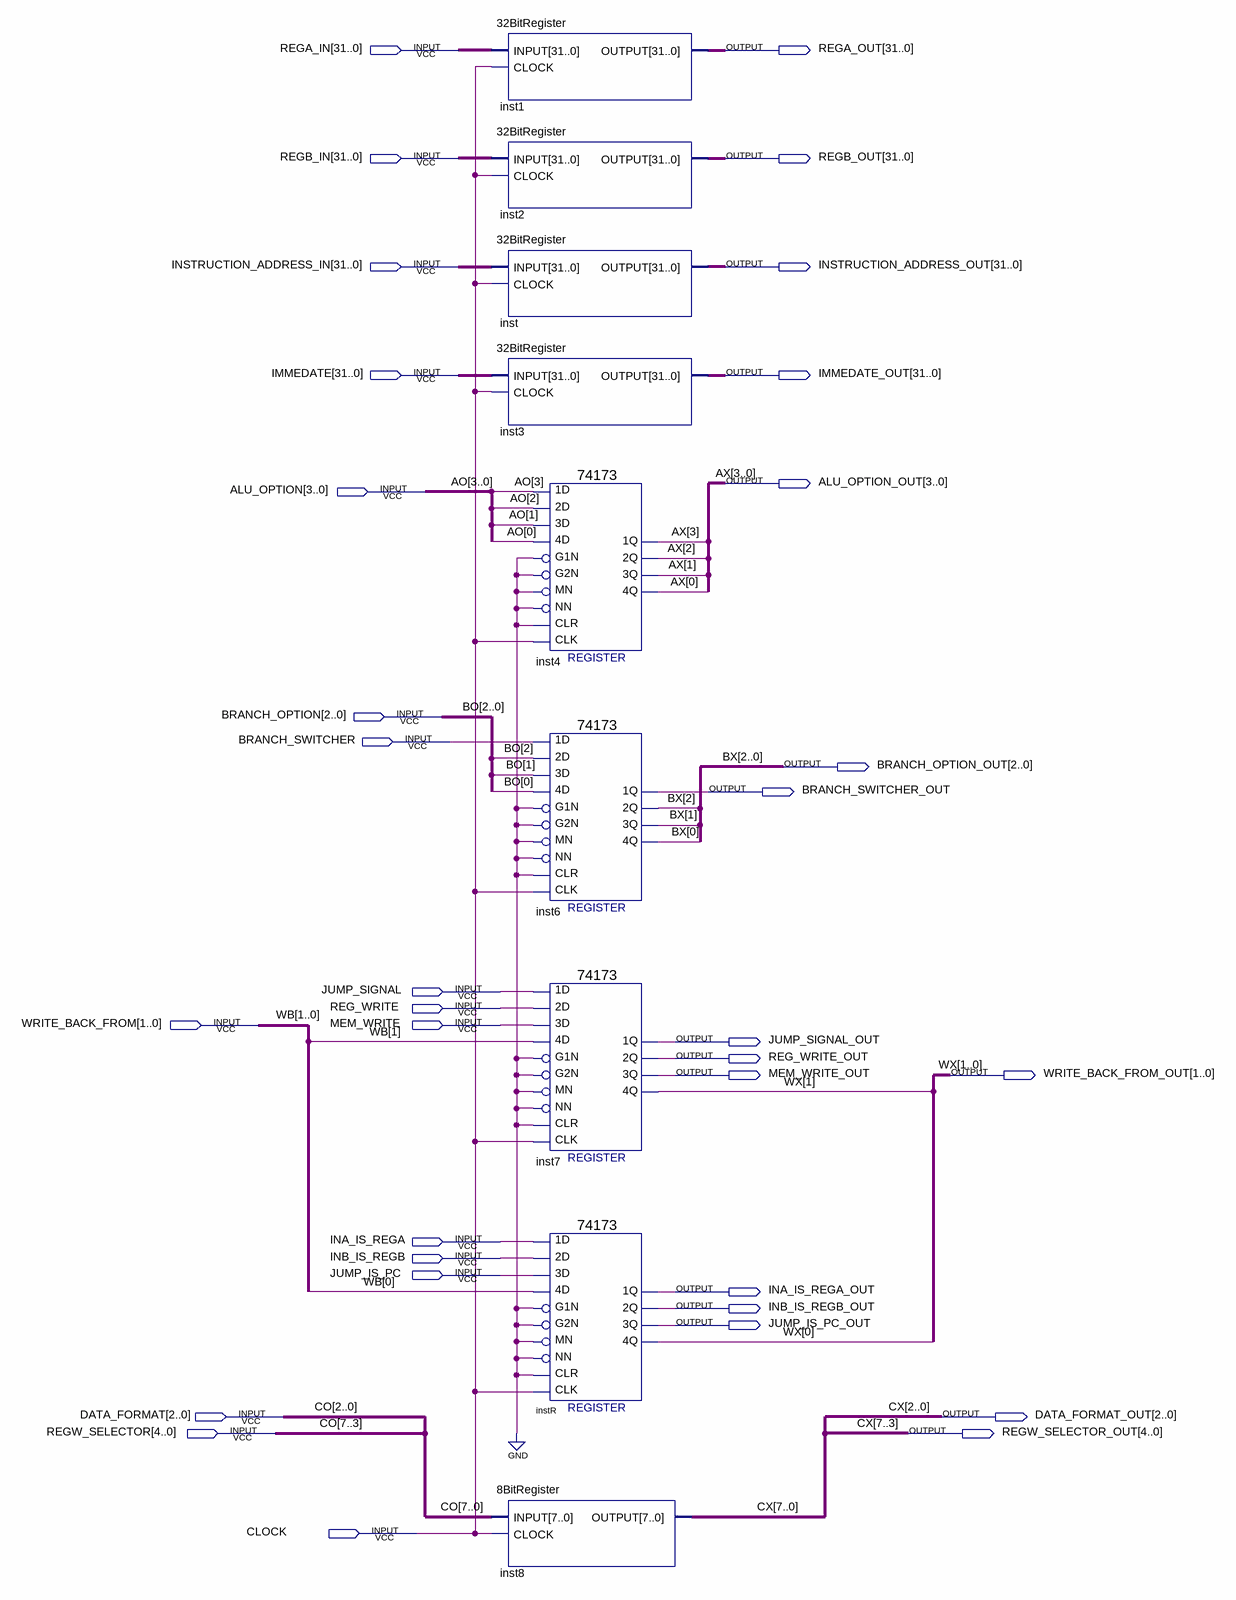
[diagram p0: schematic sheet]
// Quartus schematic DECODE_EXECUTE.bdf as structural Verilog: 9 symbols, 33 pins
module DECODE_EXECUTE (
  input  [31:0] REGA_IN,
  input  [31:0] REGB_IN,
  input  [31:0] INSTRUCTION_ADDRESS_IN,
  input  [31:0] IMMEDATE,
  input  [3:0] ALU_OPTION,
  input  [2:0] BRANCH_OPTION,
  input  BRANCH_SWITCHER,
  input  JUMP_SIGNAL,
  input  REG_WRITE,
  input  [1:0] WRITE_BACK_FROM,
  input  MEM_WRITE,
  input  INA_IS_REGA,
  input  INB_IS_REGB,
  input  JUMP_IS_PC,
  input  [2:0] DATA_FORMAT,
  input  [4:0] REGW_SELECTOR,
  input  CLOCK,
  output [31:0] REGA_OUT,
  output [31:0] REGB_OUT,
  output [31:0] INSTRUCTION_ADDRESS_OUT,
  output [31:0] IMMEDATE_OUT,
  output [3:0] ALU_OPTION_OUT,
  output [2:0] BRANCH_OPTION_OUT,
  output BRANCH_SWITCHER_OUT,
  output JUMP_SIGNAL_OUT,
  output REG_WRITE_OUT,
  output MEM_WRITE_OUT,
  output [1:0] WRITE_BACK_FROM_OUT,
  output INA_IS_REGA_OUT,
  output INB_IS_REGB_OUT,
  output JUMP_IS_PC_OUT,
  output [2:0] DATA_FORMAT_OUT,
  output [4:0] REGW_SELECTOR_OUT
);

  \32BitRegister  inst1 (.INPUT(REGA_IN), .CLOCK(CLOCK), .OUTPUT(REGA_OUT));
  \32BitRegister  inst2 (.INPUT(REGB_IN), .CLOCK(CLOCK), .OUTPUT(REGB_OUT));
  \32BitRegister  inst (.INPUT(INSTRUCTION_ADDRESS_IN), .CLOCK(CLOCK), .OUTPUT(INSTRUCTION_ADDRESS_OUT));
  \32BitRegister  inst3 (.INPUT(IMMEDATE), .CLOCK(CLOCK), .OUTPUT(IMMEDATE_OUT));
  \8BitRegister  inst8 (
    .INPUT({REGW_SELECTOR, DATA_FORMAT}), .CLOCK(CLOCK), .OUTPUT({REGW_SELECTOR_OUT, DATA_FORMAT_OUT}));
  \74173  inst4 (
    .\3D (ALU_OPTION[1]), .MN(1'b0), .\1D (ALU_OPTION[3]), .\2D (ALU_OPTION[2]), .\4D (ALU_OPTION[0]),
    .G1N(1'b0), .G2N(1'b0), .NN(1'b0), .CLR(1'b0), .CLK(CLOCK), .\3Q (ALU_OPTION_OUT[1]),
    .\2Q (ALU_OPTION_OUT[2]), .\1Q (ALU_OPTION_OUT[3]), .\4Q (ALU_OPTION_OUT[0]));
  \74173  inst6 (
    .\3D (BRANCH_OPTION[1]), .MN(1'b0), .\1D (BRANCH_SWITCHER), .\2D (BRANCH_OPTION[2]),
    .\4D (BRANCH_OPTION[0]), .G1N(1'b0), .G2N(1'b0), .NN(1'b0), .CLR(1'b0), .CLK(CLOCK),
    .\3Q (BRANCH_OPTION_OUT[1]), .\2Q (BRANCH_OPTION_OUT[2]), .\1Q (BRANCH_SWITCHER_OUT),
    .\4Q (BRANCH_OPTION_OUT[0]));
  \74173  inst7 (
    .\3D (MEM_WRITE), .MN(1'b0), .\1D (JUMP_SIGNAL), .\2D (REG_WRITE), .\4D (WRITE_BACK_FROM[1]), .G1N(1'b0),
    .G2N(1'b0), .NN(1'b0), .CLR(1'b0), .CLK(CLOCK), .\3Q (MEM_WRITE_OUT), .\2Q (REG_WRITE_OUT),
    .\1Q (JUMP_SIGNAL_OUT), .\4Q (WRITE_BACK_FROM_OUT[1]));
  \74173  instR (
    .\3D (JUMP_IS_PC), .MN(1'b0), .\1D (INA_IS_REGA), .\2D (INB_IS_REGB), .\4D (WRITE_BACK_FROM[0]),
    .G1N(1'b0), .G2N(1'b0), .NN(1'b0), .CLR(1'b0), .CLK(CLOCK), .\3Q (JUMP_IS_PC_OUT),
    .\2Q (INB_IS_REGB_OUT), .\1Q (INA_IS_REGA_OUT), .\4Q (WRITE_BACK_FROM_OUT[0]));

  // Other names for the same wires on the sheet: AO[3:0] = ALU_OPTION; AX[3:0] = ALU_OPTION_OUT;
  //   BO[2:0] = BRANCH_OPTION; BX[2:0] = BRANCH_OPTION_OUT; CO[7:0] = {REGW_SELECTOR, DATA_FORMAT};
  //   CX[7:0] = {REGW_SELECTOR_OUT, DATA_FORMAT_OUT}; WB[1:0] = WRITE_BACK_FROM; WX[1:0] = WRITE_BACK_FROM_OUT
endmodule
